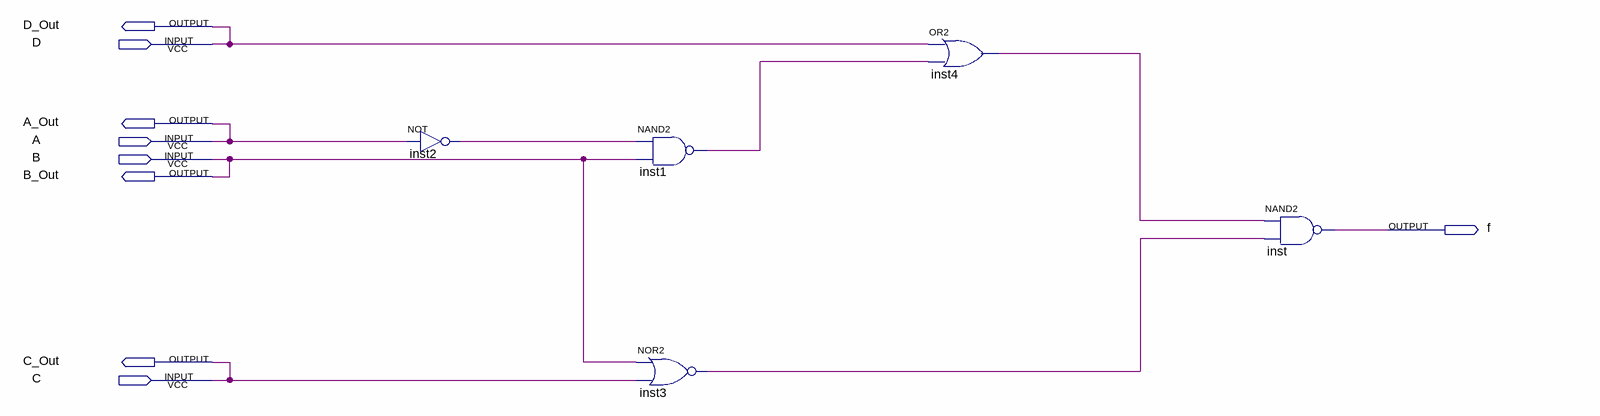
[diagram p0: schematic sheet]
// Quartus schematic Lab1.bdf as structural Verilog: 5 symbols, 9 pins
module Lab1 (
  input  D,
  input  A,
  input  B,
  input  C,
  output D_Out,
  output A_Out,
  output B_Out,
  output f,
  output C_Out
);

  wire inst1_out, inst2_out, inst3_out, inst4_out;

  not inst2 (inst2_out, A);
  nand inst1 (inst1_out, inst2_out, B);
  nor inst3 (inst3_out, B, C);
  or inst4 (inst4_out, D, inst1_out);
  nand inst (f, inst4_out, inst3_out);

  assign A_Out = A;
  assign B_Out = B;
  assign C_Out = C;
  assign D_Out = D;
endmodule
